# EAGLE design schem (EAGLE 5.10)
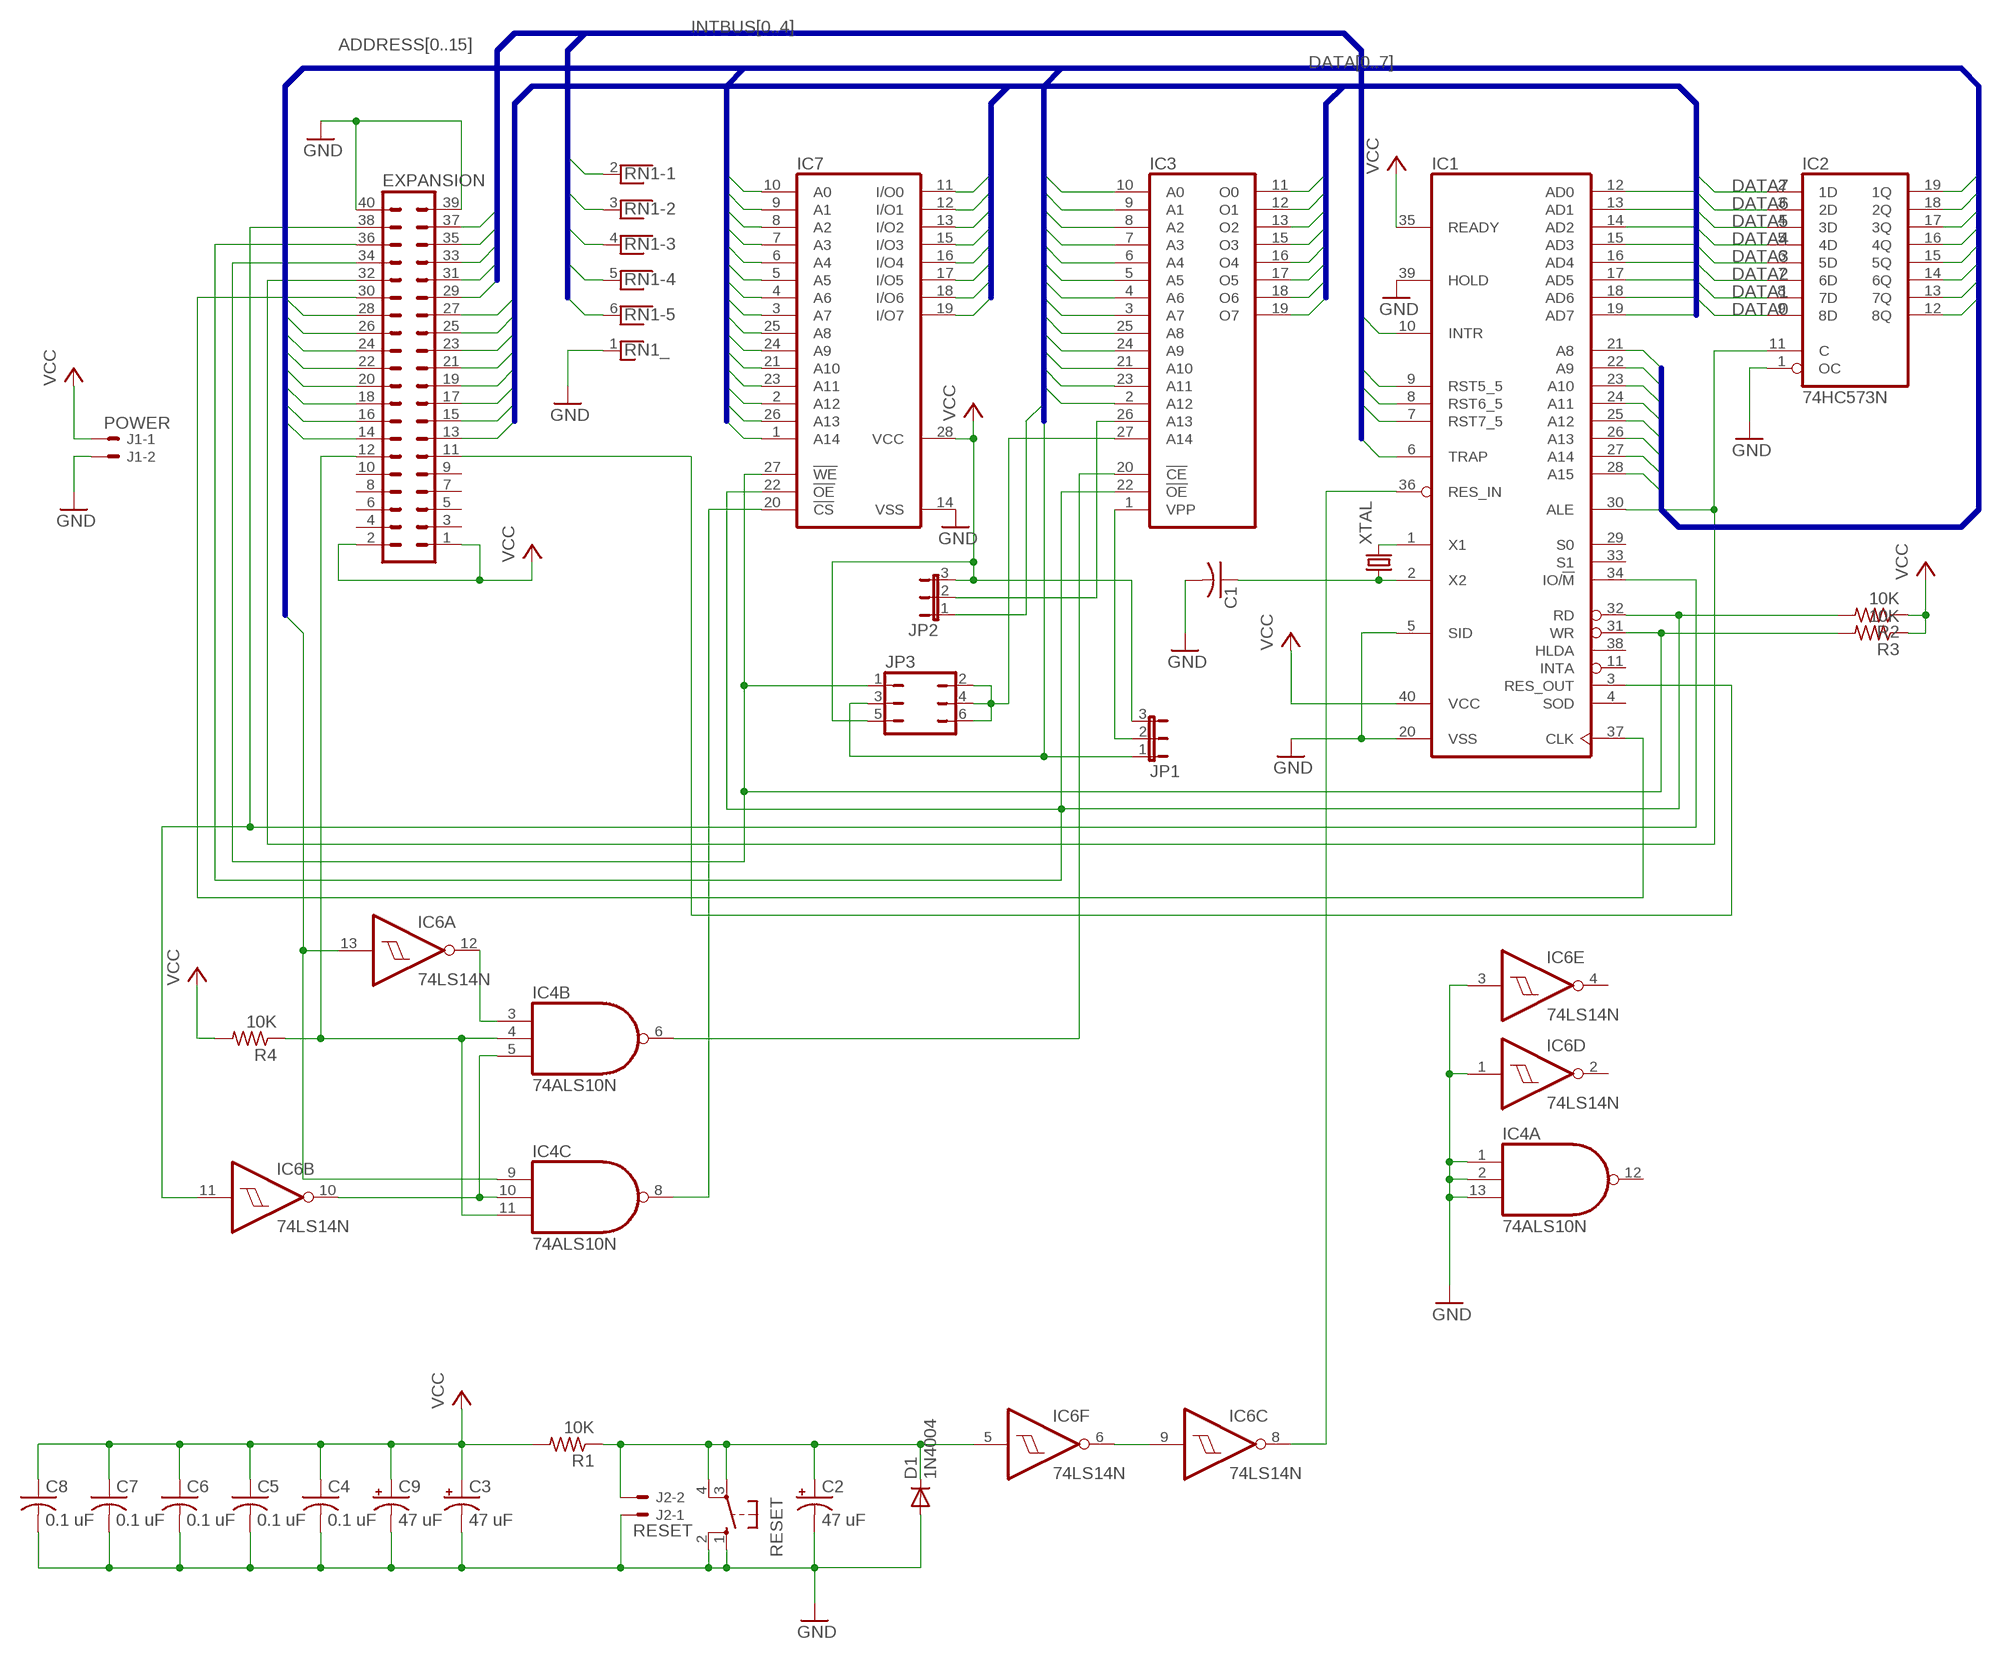
[diagram p0: schematic, sheet 1]

## Parts
C1  C-US050-024X044  [C050-024X044]
C2  47 uF  CPOL-USE2,5-6E  [E2,5-6E]
C3  47 uF  CPOL-USE15-6AXIAL  [E15-6]
C4  0.1 uF  C-US075-032X103  [C075-032X103]
C5  0.1 uF  C-US075-032X103  [C075-032X103]
C6  0.1 uF  C-US075-032X103  [C075-032X103]
C7  0.1 uF  C-US075-032X103  [C075-032X103]
C8  0.1 uF  C-US075-032X103  [C075-032X103]
C9  47 uF  CPOL-USE15-6AXIAL  [E15-6]
D1  1N4004  [DO41-10]
EXPANSION  MA20-2W  [MA20-2W]
IC1  8085  [DIL40]
IC2  74HC573N  [DIL20]
IC3  27256  [DIL28]
IC4  74ALS10N  [DIL14]
IC6  74LS14N  [DIL14]
IC7  62256P  [DIL28-6]
J1  POWER  22-05-7028-02  [7395-02]
J2  RESET  22-05-7028-02  [7395-02]
JP1  JP2E  [JP2]
JP2  JP2E  [JP2]
JP3  JP3Q  [JP3Q]
R1  10K  R-US_0207/10  [0207/10]
R2  10K  R-US_0207/10  [0207/10]
R3  10K  R-US_0207/10  [0207/10]
R4  10K  R-US_0207/10  [0207/10]
RESET  10-XX  [B3F-10XX]
RN1  RNX5  [RN-6]
XTAL  CRYSTALHC49S  [HC49/S]

## Nets
/MASK: EXPANSION.12 IC4.4(B:I1) IC4.11(C:I2) R4.1
ADDRESS0: IC2.12(8Q) IC3.10(A0) IC7.10(A0)
ADDRESS1: IC2.13(7Q) IC3.9(A1) IC7.9(A1)
ADDRESS2: IC2.14(6Q) IC3.8(A2) IC7.8(A2)
ADDRESS3: IC2.15(5Q) IC3.7(A3) IC7.7(A3)
ADDRESS4: IC2.16(4Q) IC3.6(A4) IC7.6(A4)
ADDRESS5: IC2.17(3Q) IC3.5(A5) IC7.5(A5)
ADDRESS6: IC2.18(2Q) IC3.4(A6) IC7.4(A6)
ADDRESS7: IC2.19(1Q) IC3.3(A7) IC7.3(A7)
ADDRESS8: EXPANSION.14 IC1.21(A8) IC3.25(A8) IC7.25(A8)
ADDRESS9: EXPANSION.16 IC1.22(A9) IC3.24(A9) IC7.24(A9)
ADDRESS10: EXPANSION.18 IC1.23(A10) IC3.21(A10) IC7.21(A10)
ADDRESS11: EXPANSION.20 IC1.24(A11) IC3.23(A11) IC7.23(A11)
ADDRESS12: EXPANSION.22 IC1.25(A12) IC3.2(A12) IC7.2(A12)
ADDRESS13: EXPANSION.24 IC1.26(A13) IC7.26(A13) JP2.1
ADDRESS14: EXPANSION.26 IC1.27(A14) IC7.1(A14) JP1.1 JP3.3
ADDRESS15: EXPANSION.28 IC1.28(A15) IC4.9(C:I0) IC6.13(A:I)
ALE: EXPANSION.32 IC1.30(ALE) IC2.11(C)
CLKOUT: EXPANSION.30 IC1.37(CLK)
DATA0: EXPANSION.27 IC1.12(AD0) IC2.9(8D) IC3.11(O0) IC7.11(I/O0)
DATA1: EXPANSION.25 IC1.13(AD1) IC2.8(7D) IC3.12(O1) IC7.12(I/O1)
DATA2: EXPANSION.23 IC1.14(AD2) IC2.7(6D) IC3.13(O2) IC7.13(I/O2)
DATA3: EXPANSION.21 IC1.15(AD3) IC2.6(5D) IC3.15(O3) IC7.15(I/O3)
DATA4: EXPANSION.19 IC1.16(AD4) IC2.5(4D) IC3.16(O4) IC7.16(I/O4)
DATA5: EXPANSION.17 IC1.17(AD5) IC2.4(3D) IC3.17(O5) IC7.17(I/O5)
DATA6: EXPANSION.15 IC1.18(AD6) IC2.3(2D) IC3.18(O6) IC7.18(I/O6)
DATA7: EXPANSION.13 IC1.19(AD7) IC2.2(1D) IC3.19(O7) IC7.19(I/O7)
GND: C1.2 C2.- C3.- C4.2 C5.2 C6.2 C7.2 C8.2 C9.- D1.A EXPANSION.39 EXPANSION.40 IC1.5(SID) IC1.20(VSS) IC1.39(HOLD) IC2.1(OC) IC4.1(A:I0) IC4.2(A:I1) IC4.13(A:I2) IC6.1(D:I) IC6.3(E:I) IC7.14(VSS) J1.2 J2.1 RESET.1(S) RESET.2(S1) RN1.1
INTBUS0: EXPANSION.37 IC1.6(TRAP) RN1.2
INTBUS1: EXPANSION.35 IC1.7(RST7_5) RN1.3
INTBUS2: EXPANSION.33 IC1.8(RST6_5) RN1.4
INTBUS3: EXPANSION.31 IC1.9(RST5_5) RN1.5
INTBUS4: EXPANSION.29 IC1.10(INTR) RN1.6
IO/M: EXPANSION.38 IC1.34(IO/!M) IC6.11(B:I)
N$1: IC6.6(F:O) IC6.9(C:I)
N$2: IC3.1(VPP) JP1.2
N$3: IC4.8(C:O) IC7.20(!CS)
N$4: IC1.36(RES_IN) IC6.8(C:O)
N$5: IC3.20(!CE) IC4.6(B:O)
N$7: IC3.26(A13) JP2.2
N$8: IC1.1(X1) XTAL.2
N$9: IC4.5(B:I2) IC4.10(C:I1) IC6.10(B:O)
N$10: C1.1 IC1.2(X2) XTAL.1
N$11: IC3.27(A14) JP3.2 JP3.4 JP3.6
N$12: IC4.3(B:I0) IC6.12(A:O)
RD: EXPANSION.36 IC1.32(RD) IC3.22(!OE) IC7.22(!OE) R2.2
RESET_IN: C2.+ D1.C IC6.5(F:I) J2.2 R1.1 RESET.3(P) RESET.4(P1)
RESOUT: EXPANSION.11 IC1.3(RES_OUT)
VCC: C3.+ C4.1 C5.1 C6.1 C7.1 C8.1 C9.+ EXPANSION.1 EXPANSION.2 IC1.35(READY) IC1.40(VCC) IC7.28(VCC) J1.1 JP1.3 JP2.3 JP3.5 R1.2 R2.1 R3.1 R4.2
WR: EXPANSION.34 IC1.31(WR) IC7.27(!WE) JP3.1 R3.2
Unconnected: EXPANSION.3 EXPANSION.4 EXPANSION.5 EXPANSION.6 EXPANSION.7 EXPANSION.8 EXPANSION.9 EXPANSION.10 IC1.4(SOD) IC1.11(INTA) IC1.29(S0) IC1.33(S1) IC1.38(HLDA) IC4.12(A:O) IC6.2(D:O) IC6.4(E:O)

## Buses
DATA[0..7]
ADDRESS[0..15]
INTBUS[0..4]

## Power pins joined to a net without a drawn wire
GND: IC2.10(GND) IC3.14(GND) IC4.7(P:GND) IC6.7(P:GND)
VCC: IC2.20(VCC) IC3.28(VCC) IC4.14(P:VCC) IC6.14(P:VCC)

## Library data of the parts
C1 C4-C8 = resistor:C-US: CAPACITOR, American symbol
C2 C3 C9 = resistor:CPOL-US: POLARIZED CAPACITOR, American symbol
D1 = diode:1N4004: DIODE general purpose rectifier, 1 A
EXPANSION = con-lstb:MA20-2W: PIN HEADER
IC1 = micro-intel:8085: MICROCOMPUTER/PERIPHERAL DEVICE
IC2 = 74xx-us:74*573: 8-bit D latch BUS DRIVER
IC3 = memory:27256: MEMORY
IC4 = 74xx-us:74*10: Triple 3-input NAND gate
IC6 = 74xx-us:74*14: Hex schmitt trigger INVERTER
IC7 = memory-hitachi:62256P: MEMORY
J1 J2 = con-molex:22-?-02: CONNECTOR wire to board 2.54 mm (.1 inch) pitch header
JP1 JP2 = jumper:JP2E: JUMPER
JP3 = jumper:JP3Q: JUMPER
R1-R4 = resistor:R-US_: RESISTOR, American symbol
RESET = switch-omron:10-XX: OMRON SWITCH
RN1 = resistor-net:RNX5: RESISTOR NETWORK
XTAL = crystal:CRYSTAL: CRYSTAL

## Board
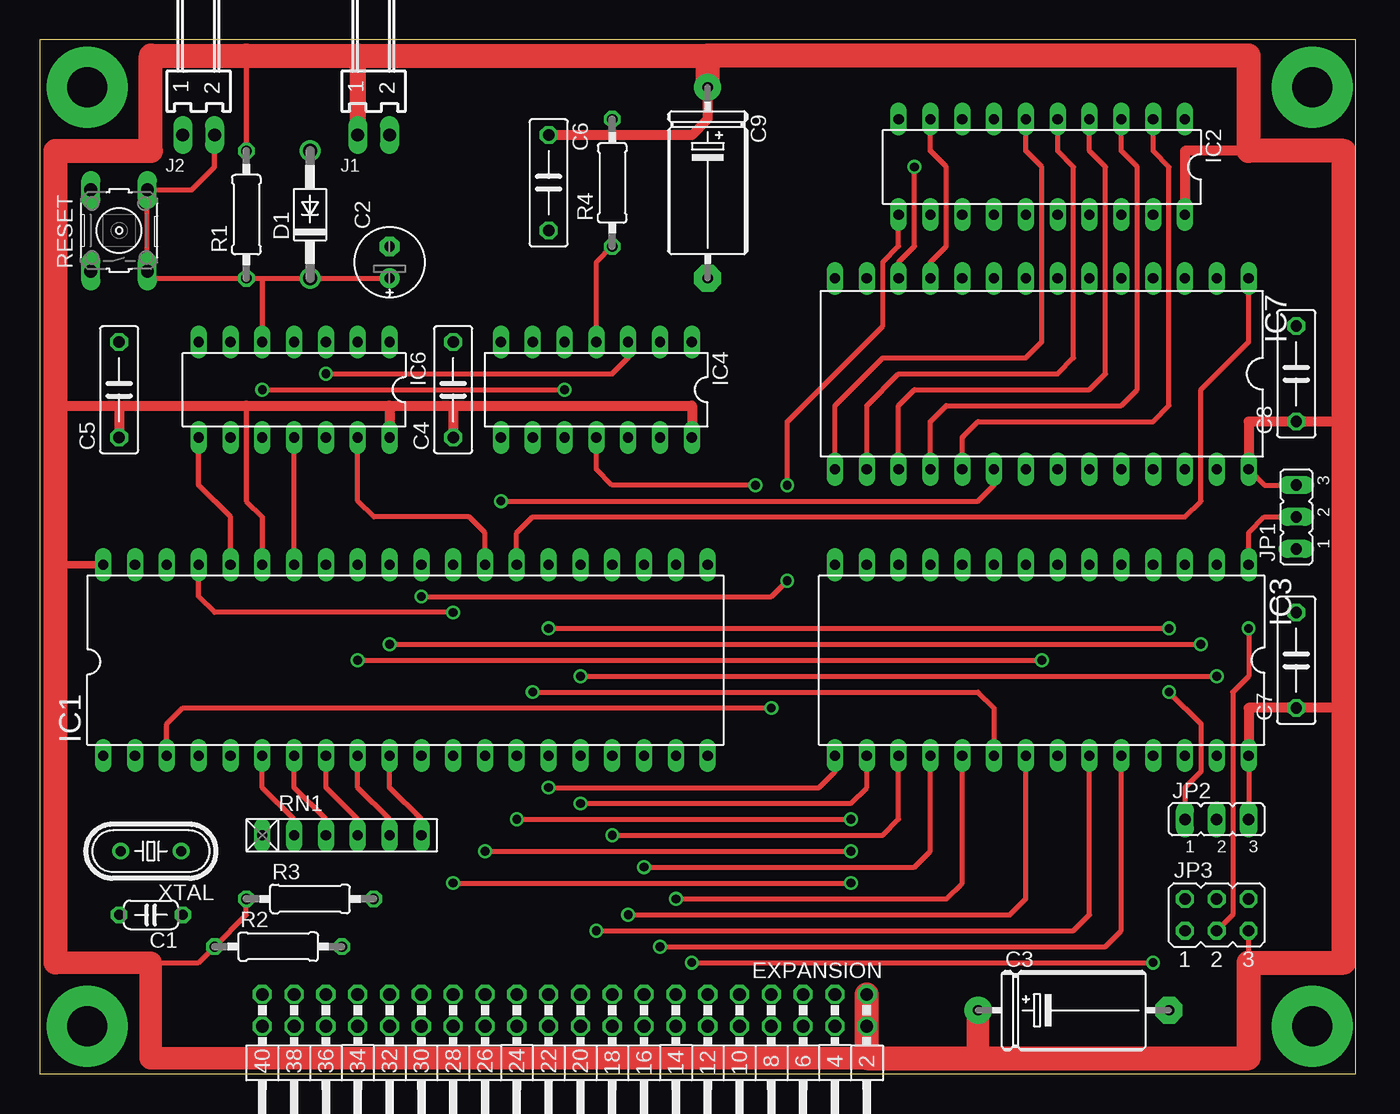
[diagram p1: board, top side]
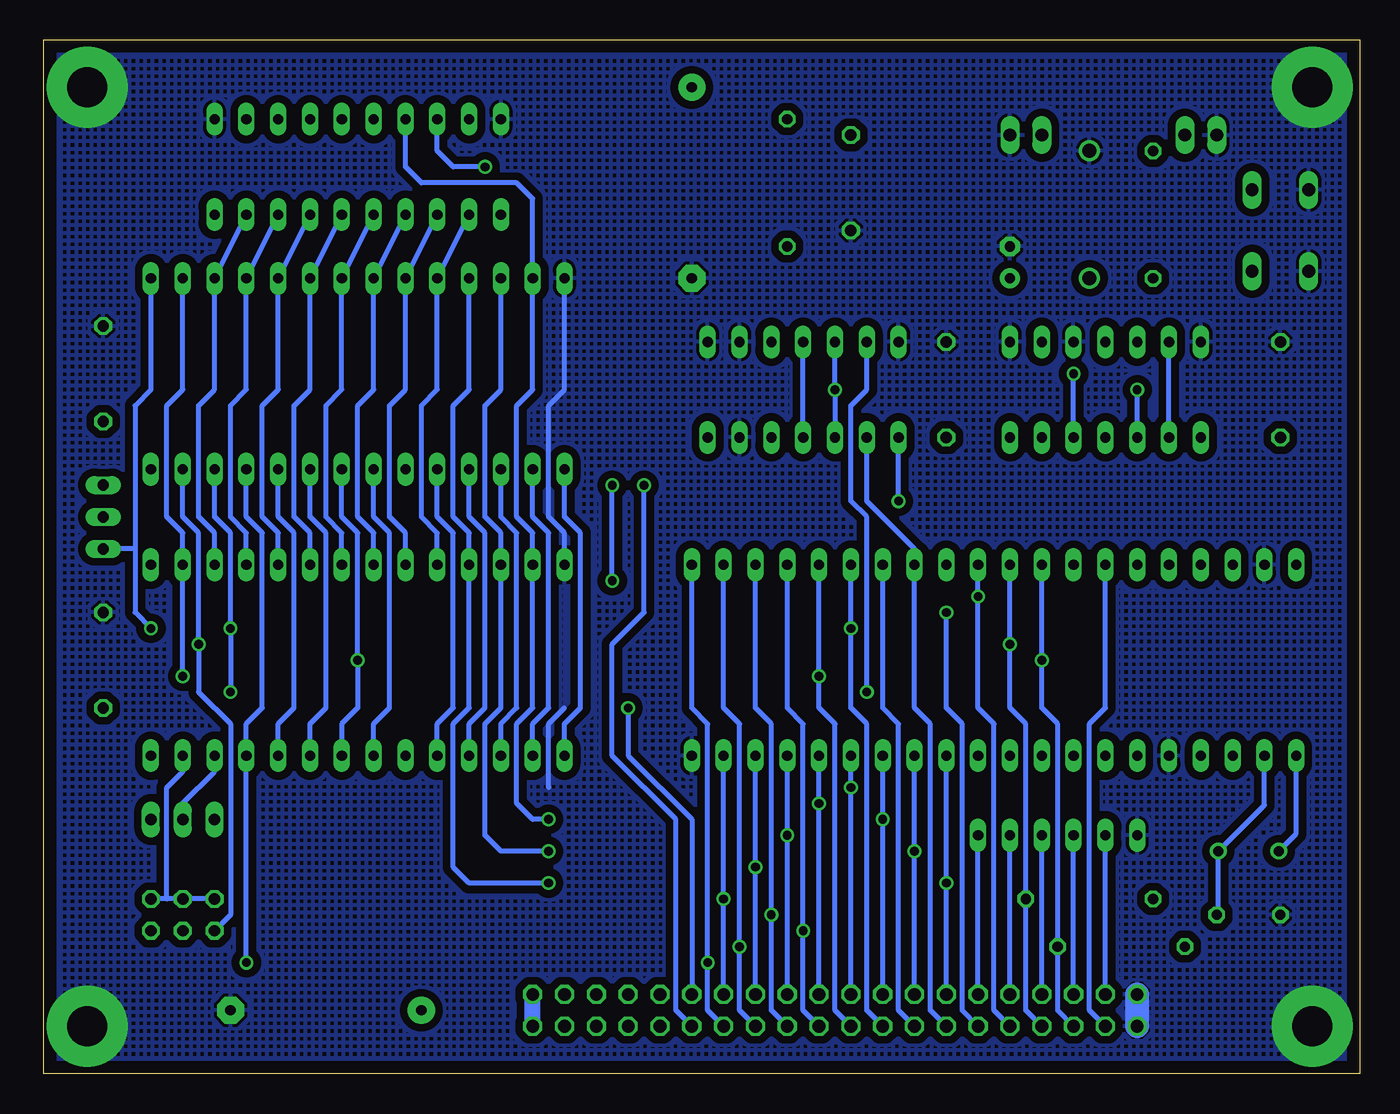
[diagram p2: board, bottom side, seen from below]

Size 105.08 x 82.54 mm. Coordinates in mm from the lower left corner, seen from the top.
Outline: 0,0 105.08,0 105.08,82.54 0,82.54 0,0
Copper layers (1*16): Top 0.035mm / dielectric 1.5mm / Bottom 0.035mm
Design rules "default *": minimum track width 10mil, minimum drill 15mil, track to track 8mil, track to pad 8mil, pad to pad 8mil, via to via 8mil, smd to smd 8mil, copper to edge 40mil, drill to drill 8mil, minimum pad ring 10mil, minimum via ring 8mil, stop-mask expansion 4mil, vias tented up to drill 0mil, thermal gap 10mil

### Footprints (pad centres in the part's own frame; a part is rotated, then mirrored left to right if it is on the bottom)
C050-024X044 = drill 0.813 octagon: 1 -2.54,0; 2 2.54,0
E2,5-6E = drill 0.813 pad 1.575 round: + -1.27,0 | drill 0.813 pad 1.575 octagon: - 1.27,0
E15-6 = drill 0.813 pad 2.159 round: + -7.62,0 | drill 0.813 pad 2.159 octagon: - 7.62,0
C075-032X103 = drill 0.914 octagon: 1 -3.81,0; 2 3.81,0
DO41-10 = drill 1.118 round: A 5.08,0; C -5.08,0
MA20-2W = drill 1.016 octagon: 1 -24.13,-1.27; 2 -24.13,1.27; 3 -21.59,-1.27; 4 -21.59,1.27; 5 -19.05,-1.27; 6 -19.05,1.27; 7 -16.51,-1.27; 8 -16.51,1.27; 9 -13.97,-1.27; 10 -13.97,1.27; 11 -11.43,-1.27; 12 -11.43,1.27; 13 -8.89,-1.27; 14 -8.89,1.27; 15 -6.35,-1.27; 16 -6.35,1.27; 17 -3.81,-1.27; 18 -3.81,1.27; 19 -1.27,-1.27; 20 -1.27,1.27; 21 1.27,-1.27; 22 1.27,1.27; 23 3.81,-1.27; 24 3.81,1.27; 25 6.35,-1.27; 26 6.35,1.27; 27 8.89,-1.27; 28 8.89,1.27; 29 11.43,-1.27; 30 11.43,1.27; 31 13.97,-1.27; 32 13.97,1.27; 33 16.51,-1.27; 34 16.51,1.27; 35 19.05,-1.27; 36 19.05,1.27; 37 21.59,-1.27; 38 21.59,1.27; 39 24.13,-1.27; 40 24.13,1.27
DIL40 = drill 0.813 long: 1 -24.13,-7.62; 2 -21.59,-7.62; 3 -19.05,-7.62; 4 -16.51,-7.62; 5 -13.97,-7.62; 6 -11.43,-7.62; 7 -8.89,-7.62; 8 -6.35,-7.62; 9 -3.81,-7.62; 10 -1.27,-7.62; 11 1.27,-7.62; 12 3.81,-7.62; 13 6.35,-7.62; 14 8.89,-7.62; 15 11.43,-7.62; 16 13.97,-7.62; 17 16.51,-7.62; 18 19.05,-7.62; 19 21.59,-7.62; 20 24.13,-7.62; 21 24.13,7.62; 22 21.59,7.62; 23 19.05,7.62; 24 16.51,7.62; 25 13.97,7.62; 26 11.43,7.62; 27 8.89,7.62; 28 6.35,7.62; 29 3.81,7.62; 30 1.27,7.62; 31 -1.27,7.62; 32 -3.81,7.62; 33 -6.35,7.62; 34 -8.89,7.62; 35 -11.43,7.62; 36 -13.97,7.62; 37 -16.51,7.62; 38 -19.05,7.62; 39 -21.59,7.62; 40 -24.13,7.62
DIL20 = drill 0.813 long: 1 -11.43,-3.81; 2 -8.89,-3.81; 3 -6.35,-3.81; 4 -3.81,-3.81; 5 -1.27,-3.81; 6 1.27,-3.81; 7 3.81,-3.81; 8 6.35,-3.81; 9 8.89,-3.81; 10 11.43,-3.81; 11 11.43,3.81; 12 8.89,3.81; 13 6.35,3.81; 14 3.81,3.81; 15 1.27,3.81; 16 -1.27,3.81; 17 -3.81,3.81; 18 -6.35,3.81; 19 -8.89,3.81; 20 -11.43,3.81
DIL28 = drill 0.813 long: 1 -16.51,-7.62; 2 -13.97,-7.62; 3 -11.43,-7.62; 4 -8.89,-7.62; 5 -6.35,-7.62; 6 -3.81,-7.62; 7 -1.27,-7.62; 8 1.27,-7.62; 9 3.81,-7.62; 10 6.35,-7.62; 11 8.89,-7.62; 12 11.43,-7.62; 13 13.97,-7.62; 14 16.51,-7.62; 15 16.51,7.62; 16 13.97,7.62; 17 11.43,7.62; 18 8.89,7.62; 19 6.35,7.62; 20 3.81,7.62; 21 1.27,7.62; 22 -1.27,7.62; 23 -3.81,7.62; 24 -6.35,7.62; 25 -8.89,7.62; 26 -11.43,7.62; 27 -13.97,7.62; 28 -16.51,7.62
DIL14 = drill 0.813 long: 1 -7.62,-3.81; 2 -5.08,-3.81; 3 -2.54,-3.81; 4 0,-3.81; 5 2.54,-3.81; 6 5.08,-3.81; 7 7.62,-3.81; 8 7.62,3.81; 9 5.08,3.81; 10 2.54,3.81; 11 0,3.81; 12 -2.54,3.81; 13 -5.08,3.81; 14 -7.62,3.81
DIL28-6 = drill 0.813 long: 1 -16.51,-7.62; 2 -13.97,-7.62; 3 -11.43,-7.62; 4 -8.89,-7.62; 5 -6.35,-7.62; 6 -3.81,-7.62; 7 -1.27,-7.62; 8 1.27,-7.62; 9 3.81,-7.62; 10 6.35,-7.62; 11 8.89,-7.62; 12 11.43,-7.62; 13 13.97,-7.62; 14 16.51,-7.62; 15 16.51,7.62; 16 13.97,7.62; 17 11.43,7.62; 18 8.89,7.62; 19 6.35,7.62; 20 3.81,7.62; 21 1.27,7.62; 22 -1.27,7.62; 23 -3.81,7.62; 24 -6.35,7.62; 25 -8.89,7.62; 26 -11.43,7.62; 27 -13.97,7.62; 28 -16.51,7.62
7395-02 = drill 1.016 long: 1 1.27,0; 2 -1.27,0
JP2 = drill 0.914 long: 1 -2.54,0; 2 0,0; 3 2.54,0
JP3Q = drill 0.914 octagon: 1 -2.54,-1.27; 2 -2.54,1.27; 3 0,-1.27; 4 0,1.27; 5 2.54,-1.27; 6 2.54,1.27
0207/10 = drill 0.813 octagon: 1 -5.08,0; 2 5.08,0
B3F-10XX = drill 1.016 long: 1 -3.251,2.261; 2 3.251,2.261; 3 -3.251,-2.261; 4 3.251,-2.261
RN-6 = drill 0.813 long: 1 -6.35,0; 2 -3.81,0; 3 -1.27,0; 4 1.27,0; 5 3.81,0; 6 6.35,0
HC49/S = drill 0.813 round: 1 -2.413,0; 2 2.413,0

### Placement (x,y rotation side)
C1  8.89,12.7 180 top
C2  27.94,64.77 90 top
C3  82.55,5.08 0 top
C4  33.02,54.61 90 top
C5  6.35,54.61 90 top
C6  40.64,71.12 270 top
C7  100.33,33.02 90 top
C8  100.33,55.88 90 top
C9  53.34,71.12 270 top
D1  21.59,68.58 90 top
EXPANSION  41.91,5.08 180 top
IC1  29.21,33.02 0 top
IC2  80.01,72.39 180 top
IC3  80.01,33.02 180 top
IC4  44.45,54.61 180 top
IC6  20.32,54.61 180 top
IC7  80.01,55.88 180 top
J1  26.67,74.93 180 top
J2  12.7,74.93 180 top
JP1  100.33,44.45 90 top
JP2  93.98,20.32 0 top
JP3  93.98,12.7 0 top
R1  16.51,68.58 90 top
R2  19.05,10.16 0 top
R3  21.59,13.97 0 top
R4  45.72,71.12 90 top
RESET  6.35,67.31 90 top
RN1  24.13,19.05 0 top
XTAL  8.89,17.78 180 top

### Tracks (layer width: path | path; a pad name or v marks a point on that pad's centre or on a via)
/MASK  (via drill 0.7)
  Top 0.406: v57.15,46.99 45.72,46.99 44.45,48.26 IC4.11 | R4.1 44.45,64.77 IC4.4
  Bottom 0.406: EXPANSION.12 54.61,5.08 54.61,20.32 59.69,25.4 59.69,34.29 57.15,36.83 v57.15,46.99 | IC4.11 IC4.4
ADDRESS0
  Bottom 0.406: IC2.12 IC7.10 73.66,54.61 74.93,53.34 74.93,44.45 73.66,43.18 IC3.10
ADDRESS1
  Bottom 0.406: IC2.13 IC7.9 76.2,54.61 77.47,53.34 77.47,44.45 76.2,43.18 IC3.9
ADDRESS2
  Bottom 0.406: IC2.14 IC7.8 78.74,54.61 80.01,53.34 80.01,44.45 78.74,43.18 IC3.8
ADDRESS3
  Bottom 0.406: IC2.15 IC7.7 81.28,54.61 82.55,53.34 82.55,44.45 81.28,43.18 IC3.7
ADDRESS4
  Bottom 0.406: IC2.16 IC7.6 83.82,54.61 85.09,53.34 85.09,44.45 83.82,43.18 IC3.6
ADDRESS5
  Bottom 0.406: IC2.17 IC7.5 86.36,54.61 87.63,53.34 87.63,44.45 86.36,43.18 IC3.5
ADDRESS6
  Bottom 0.406: IC2.18 IC7.4 88.9,54.61 90.17,53.34 90.17,44.45 88.9,43.18 IC3.4
ADDRESS7
  Bottom 0.406: IC2.19 IC7.3 91.44,54.61 92.71,53.34 92.71,44.45 91.44,43.18 IC3.3
ADDRESS8  (via drill 0.7)
  Top 0.406: v52.07,8.89 v88.9,8.89
  Bottom 0.406: IC1.21 53.34,29.21 52.07,27.94 v52.07,8.89 52.07,5.08 EXPANSION.14 | IC7.25 88.9,44.45 87.63,43.18 87.63,29.21 88.9,27.94 IC3.25 v88.9,8.89
ADDRESS9  (via drill 0.7)
  Top 0.406: v49.53,10.16 85.09,10.16 86.36,11.43 IC3.24
  Bottom 0.406: IC1.22 50.8,29.21 49.53,27.94 v49.53,10.16 49.53,5.08 EXPANSION.16 | IC7.24 86.36,44.45 85.09,43.18 85.09,29.21 86.36,27.94 IC3.24
ADDRESS10  (via drill 0.7)
  Top 0.406: v46.99,12.7 77.47,12.7 78.74,13.97 IC3.21
  Bottom 0.406: IC1.23 48.26,29.21 46.99,27.94 v46.99,12.7 46.99,5.08 EXPANSION.18 | IC7.21 78.74,44.45 77.47,43.18 77.47,29.21 78.74,27.94 IC3.21
ADDRESS11  (via drill 0.7)
  Top 0.406: v44.45,11.43 82.55,11.43 83.82,12.7 IC3.23
  Bottom 0.406: IC1.24 45.72,29.21 44.45,27.94 v44.45,11.43 44.45,5.08 EXPANSION.20 | IC7.23 83.82,44.45 82.55,43.18 82.55,29.21 83.82,27.94 IC3.23
ADDRESS12  (via drill 0.7)
  Top 0.406: v43.18,31.75 v93.98,31.75
  Bottom 0.406: IC1.25 v43.18,31.75 43.18,29.21 41.91,27.94 41.91,5.08 EXPANSION.22 | IC7.2 93.98,54.61 95.25,53.34 95.25,44.45 93.98,43.18 IC3.2 v93.98,31.75
ADDRESS13  (via drill 0.7)
  Top 0.406: v40.64,35.56 v90.17,35.56 | JP2.1 91.44,22.86 92.71,24.13 92.71,27.94 v90.17,30.48
  Bottom 0.406: IC1.26 v40.64,35.56 40.64,29.21 39.37,27.94 39.37,5.08 EXPANSION.24 | IC7.26 91.44,44.45 90.17,43.18 v90.17,35.56 v90.17,30.48
ADDRESS14  (via drill 0.7)
  Top 0.406: IC7.1 96.52,58.42 92.71,54.61 92.71,45.72 91.44,44.45 39.37,44.45 38.1,43.18 IC1.27 | v96.52,35.56 96.52,31.75 95.25,30.48 95.25,12.7 JP3.3
  Bottom 0.406: IC1.27 38.1,29.21 36.83,27.94 36.83,5.08 EXPANSION.26 | v96.52,35.56 97.79,36.83 97.79,41.91 | 97.79,41.91 97.79,53.34 96.52,54.61 IC7.1 | 97.79,41.91 JP1.1
ADDRESS15
  Top 0.406: IC1.28 35.56,43.18 34.29,44.45 26.67,44.45 25.4,45.72 IC6.13
  Bottom 0.406: EXPANSION.28 34.29,5.08 34.29,27.94 35.56,29.21 IC1.28 35.56,41.91 39.37,45.72 IC4.9
ALE  (via drill 0.7, 0.7 pad 0.81)
  Top 0.406: v30.48,38.1 58.42,38.1 v59.69,39.37 | IC2.11 68.58,66.04 67.31,64.77 67.31,59.69 59.69,52.07 v59.69,46.99
  Bottom 0.406: IC1.30 v30.48,38.1 30.48,29.21 29.21,27.94 29.21,5.08 EXPANSION.32 | v59.69,39.37 v59.69,46.99
CLKOUT  (via drill 0.7)
  Top 0.406: v33.02,36.83 13.97,36.83 12.7,38.1 IC1.37
  Bottom 0.406: EXPANSION.30 31.75,5.08 31.75,27.94 33.02,29.21 v33.02,36.83
DATA0  (via drill 0.7)
  Top 0.406: IC2.9 71.12,73.66 72.39,72.39 72.39,66.04 71.12,64.77 IC7.11 | v33.02,15.24 v64.77,15.24
  Bottom 0.406: EXPANSION.27 v33.02,15.24 IC1.12 | v64.77,15.24 71.12,15.24 72.39,16.51 72.39,27.94 71.12,29.21 IC3.11 71.12,43.18 72.39,44.45 72.39,53.34 71.12,54.61 IC7.11
DATA1  (via drill 0.7, 0.7 pad 0.81)
  Top 0.406: v35.56,17.78 v64.77,17.78 | IC7.12 68.58,64.77 69.85,66.04 v69.85,72.39
  Bottom 0.406: EXPANSION.25 v35.56,17.78 IC1.13 | v64.77,17.78 68.58,17.78 69.85,19.05 69.85,27.94 68.58,29.21 IC3.12 68.58,43.18 69.85,44.45 69.85,53.34 68.58,54.61 IC7.12 | v69.85,72.39 72.39,72.39 73.66,73.66 IC2.8
DATA2  (via drill 0.7)
  Top 0.406: v38.1,20.32 v64.77,20.32
  Bottom 0.406: EXPANSION.23 v38.1,20.32 IC1.14 | v64.77,20.32 66.04,20.32 67.31,21.59 67.31,27.94 66.04,29.21 IC3.13 66.04,43.18 67.31,44.45 67.31,53.34 66.04,54.61 IC7.13 66.04,69.85 67.31,71.12 74.93,71.12 76.2,72.39 IC2.7
DATA3  (via drill 0.7)
  Top 0.406: IC2.6 78.74,73.66 80.01,72.39 80.01,58.42 78.74,57.15 67.31,57.15 63.5,53.34 IC7.15 | v40.64,22.86 62.23,22.86 63.5,24.13 IC3.15
  Bottom 0.406: EXPANSION.21 v40.64,22.86 IC1.15 | IC7.15 63.5,44.45 62.23,43.18 62.23,29.21 63.5,27.94 IC3.15
DATA4  (via drill 0.7)
  Top 0.406: IC2.5 81.28,73.66 82.55,72.39 82.55,57.15 81.28,55.88 68.58,55.88 66.04,53.34 IC7.16 | v43.18,21.59 64.77,21.59 66.04,22.86 IC3.16
  Bottom 0.406: EXPANSION.19 v43.18,21.59 IC1.16 | IC7.16 66.04,44.45 64.77,43.18 64.77,29.21 66.04,27.94 IC3.16
DATA5  (via drill 0.7)
  Top 0.406: IC2.4 83.82,73.66 85.09,72.39 85.09,55.88 83.82,54.61 69.85,54.61 68.58,53.34 IC7.17 | v45.72,19.05 67.31,19.05 68.58,20.32 IC3.17
  Bottom 0.406: EXPANSION.17 v45.72,19.05 IC1.17 | IC7.17 68.58,44.45 67.31,43.18 67.31,29.21 68.58,27.94 IC3.17
DATA6  (via drill 0.7)
  Top 0.406: IC2.3 86.36,73.66 87.63,72.39 87.63,54.61 86.36,53.34 72.39,53.34 71.12,52.07 IC7.18 | v48.26,16.51 69.85,16.51 71.12,17.78 IC3.18
  Bottom 0.406: EXPANSION.15 v48.26,16.51 IC1.18 | IC7.18 71.12,44.45 69.85,43.18 69.85,29.21 71.12,27.94 IC3.18
DATA7  (via drill 0.7)
  Top 0.406: IC2.2 88.9,73.66 90.17,72.39 90.17,53.34 88.9,52.07 74.93,52.07 73.66,50.8 IC7.19 | v50.8,13.97 72.39,13.97 73.66,15.24 IC3.19
  Bottom 0.406: EXPANSION.13 v50.8,13.97 IC1.19 | IC7.19 73.66,44.45 72.39,43.18 72.39,29.21 73.66,27.94 IC3.19
GND  (via drill 3.2 pad 6.45)
  Bottom 0.406: IC3.14 63.5,43.18 64.77,44.45 64.77,53.34 63.5,54.61 IC7.14 | 63.5,29.21 64.77,27.94 64.77,22.86
  Bottom 1.93: EXPANSION.40 EXPANSION.39
  other vias: 101.6,3.81 3.81,3.81 3.81,78.74 101.6,78.74
  pour Bottom (isolate 0.61, hatched): 0,82.55 105.41,82.55 105.41,0 0,0
INTBUS0
  Top 0.406: IC1.6 17.78,22.86 20.32,20.32 RN1.2
  Bottom 0.406: EXPANSION.37 RN1.2
INTBUS1
  Top 0.406: IC1.7 20.32,22.86 22.86,20.32 RN1.3
  Bottom 0.406: EXPANSION.35 RN1.3
INTBUS2
  Top 0.406: IC1.8 22.86,22.86 25.4,20.32 RN1.4
  Bottom 0.406: EXPANSION.33 RN1.4
INTBUS3
  Top 0.406: IC1.9 25.4,22.86 27.94,20.32 RN1.5
  Bottom 0.406: EXPANSION.31 RN1.5
INTBUS4
  Top 0.406: IC1.10 27.94,22.86 30.48,20.32 RN1.6
  Bottom 0.406: EXPANSION.29 RN1.6
IO/M
  Top 0.406: IC1.34 IC6.11
  Bottom 0.406: IC1.34 20.32,29.21 21.59,27.94 21.59,5.08 EXPANSION.38
N$1
  Bottom 0.406: IC6.9 IC6.6
N$2
  Top 0.406: JP1.2 97.79,44.45 96.52,43.18 IC3.1
N$3  (via drill 0.7)
  Top 0.406: IC7.20 76.2,46.99 74.93,45.72 v36.83,45.72
  Bottom 0.406: v36.83,45.72 IC4.8
N$4
  Top 0.406: IC6.8 12.7,46.99 15.24,44.45 IC1.36
N$5  (via drill 0.7)
  Top 0.406: v39.37,30.48 74.93,30.48 76.2,29.21 IC3.20
  Bottom 0.406: v39.37,30.48 39.37,44.45 40.64,45.72 40.64,53.34 39.37,54.61 IC4.6
N$7
  Bottom 0.406: IC3.26 91.44,24.13 93.98,21.59 JP2.2
N$8
  Bottom 0.406: IC1.1 5.08,19.18 XTAL.2
N$9  (via drill 0.7)
  Top 0.406: v17.78,54.61 v41.91,54.61
  Bottom 0.406: IC4.10 v41.91,54.61 IC4.5 | IC6.10 v17.78,54.61
N$10
  Bottom 0.406: IC1.2 7.62,21.46 XTAL.1 11.3,12.83 C1.1
N$11
  Bottom 0.406: 95.25,13.97 JP3.4 JP3.2 | 95.25,13.97 JP3.6 | IC3.27 93.98,24.13 95.25,22.86 95.25,13.97
N$12  (via drill 0.7)
  Top 0.406: v22.86,55.88 45.72,55.88 46.99,57.15 IC4.3
  Bottom 0.406: IC6.12 v22.86,55.88
RD  (via drill 0.7)
  Top 0.406: v25.4,33.02 v80.01,33.02
  Bottom 0.406: IC1.32 v25.4,33.02 25.4,29.21 24.13,27.94 R2.2 24.13,5.08 EXPANSION.36 | IC7.22 81.28,44.45 80.01,43.18 v80.01,33.02 80.01,29.21 81.28,27.94 IC3.22
RESET_IN
  Top 0.406: J2.2 13.97,72.39 12.14,70.56 RESET.4 RESET.3 8.61,63.78 8.89,63.5 R1.1 17.78,63.5 | 17.78,63.5 D1.C C2.+ | 17.78,63.5 IC6.5
RESOUT  (via drill 0.7)
  Top 0.406: v58.42,29.21 11.43,29.21 10.16,27.94 IC1.3
  Bottom 0.406: EXPANSION.11 53.34,20.32 58.42,25.4 v58.42,29.21
VCC
  Top 0.406: 16.51,81.28 R1.2 | 96.52,8.89 JP3.5 | IC7.28 97.79,46.99 JP1.3 | R3.1 16.51,12.7 R2.1 12.7,8.89 8.89,8.89 | 45.72,74.93 R4.2 | IC1.35 17.78,44.45 16.51,45.72 16.51,53.34 | IC3.28 JP2.3
  Top 0.61: 1.27,40.64 IC1.40
  Top 0.813: IC7.28 96.52,52.07 C8.1 104.14,52.07 | IC3.28 96.52,29.21 C7.1 104.14,29.21 | 33.02,53.34 C4.1 | 1.27,53.34 6.35,53.34 | 6.35,53.34 16.51,53.34 27.94,53.34 | 27.94,53.34 33.02,53.34 | 33.02,53.34 52.07,53.34 IC4.14 | 27.94,53.34 IC6.14 | C6.1 45.72,74.93 52.07,74.93 53.34,76.2 C9.+ | 6.35,53.34 C5.1 | IC2.20 91.44,73.66 96.52,73.66
  Top 1.27: 25.4,81.28 J1.1
  Top 1.778: 1.27,8.89 8.89,8.89 8.89,1.27 66.04,1.27 | 74.93,1.27 C3.+
  Top 1.93: 53.34,81.28 96.52,81.28 96.52,73.66 104.14,73.66 104.14,52.07 104.14,29.21 104.14,8.89 96.52,8.89 96.52,1.27 74.93,1.27 66.04,1.27 EXPANSION.2 EXPANSION.1 | 53.34,81.28 25.4,81.28 16.51,81.28 8.89,81.28 8.89,73.66 1.27,73.66 1.27,53.34 1.27,40.64 1.27,8.89 | 53.34,81.28 C9.+
  Bottom 1.27: EXPANSION.2 EXPANSION.1
WR  (via drill 0.7)
  Top 0.406: v27.94,34.29 v92.71,34.29
  Bottom 0.406: IC1.31 v27.94,34.29 27.94,29.21 26.67,27.94 R3.2 26.67,5.08 EXPANSION.34 | IC7.27 93.98,44.45 92.71,43.18 v92.71,34.29 92.71,30.48 90.17,27.94 90.17,12.7 JP3.1